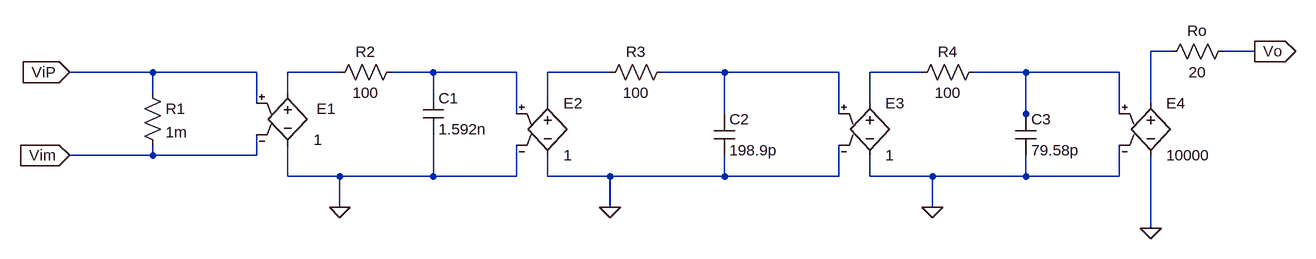
[diagram p0: schematic OpAmp.asc]
OpAmp.asc, the LTspice schematic file:
Version 4
SHEET 1 1708 680
WIRE 1488 -32 1456 -32
WIRE 1616 -32 1568 -32
WIRE -80 0 -208 0
WIRE 80 0 -80 0
WIRE 208 0 128 0
WIRE 352 0 288 0
WIRE 480 0 352 0
WIRE 624 0 528 0
WIRE 800 0 704 0
WIRE 976 0 800 0
WIRE 1104 0 1024 0
WIRE 1264 0 1184 0
WIRE 1408 0 1264 0
WIRE -80 32 -80 0
WIRE 128 32 128 0
WIRE 352 32 352 0
WIRE 80 48 80 0
WIRE 528 48 528 0
WIRE 1024 48 1024 0
WIRE 1456 48 1456 -32
WIRE 480 64 480 0
WIRE 800 64 800 0
WIRE 976 64 976 0
WIRE 1264 64 1264 0
WIRE 1408 64 1408 0
WIRE 1264 80 1264 64
WIRE -80 128 -80 112
WIRE -80 128 -208 128
WIRE 80 128 80 96
WIRE 80 128 -80 128
WIRE 128 160 128 112
WIRE 208 160 128 160
WIRE 352 160 352 96
WIRE 352 160 208 160
WIRE 480 160 480 112
WIRE 480 160 352 160
WIRE 528 160 528 128
WIRE 624 160 528 160
WIRE 800 160 800 128
WIRE 800 160 624 160
WIRE 976 160 976 112
WIRE 976 160 800 160
WIRE 1024 160 1024 128
WIRE 1120 160 1024 160
WIRE 1264 160 1264 128
WIRE 1264 160 1120 160
WIRE 1408 160 1408 112
WIRE 1408 160 1264 160
WIRE 208 208 208 160
WIRE 624 208 624 160
WIRE 1120 208 1120 160
WIRE 1456 240 1456 128
FLAG -208 0 ViP
IOPIN -208 0 In
FLAG -208 128 Vim
IOPIN -208 128 In
FLAG 208 208 0
FLAG 624 208 0
FLAG 1120 208 0
FLAG 1456 240 0
FLAG 1616 -32 Vo
IOPIN 1616 -32 Out
SYMBOL e 128 16 R0
WINDOW 0 44 40 Left 2
WINDOW 3 40 88 Left 2
SYMATTR InstName E1
SYMATTR Value 1
SYMBOL res -96 16 R0
SYMATTR InstName R1
SYMATTR Value 1m
SYMBOL res 304 -16 R90
WINDOW 0 0 56 VBottom 2
WINDOW 3 32 56 VTop 2
SYMATTR InstName R2
SYMATTR Value 100
SYMBOL cap 336 32 R0
SYMATTR InstName C1
SYMATTR Value 1.592n
SYMBOL e 528 32 R0
SYMATTR InstName E2
SYMATTR Value 1
SYMBOL res 720 -16 R90
WINDOW 0 0 56 VBottom 2
WINDOW 3 32 56 VTop 2
SYMATTR InstName R3
SYMATTR Value 100
SYMBOL cap 784 64 R0
SYMATTR InstName C2
SYMATTR Value 198.9p
SYMBOL e 1024 32 R0
SYMATTR InstName E3
SYMATTR Value 1
SYMBOL res 1200 -16 R90
WINDOW 0 0 56 VBottom 2
WINDOW 3 32 56 VTop 2
SYMATTR InstName R4
SYMATTR Value 100
SYMBOL cap 1248 64 R0
SYMATTR InstName C3
SYMATTR Value 79.58p
SYMBOL e 1456 32 R0
SYMATTR InstName E4
SYMATTR Value 10000
SYMBOL res 1584 -48 R90
WINDOW 0 0 56 VBottom 2
WINDOW 3 32 56 VTop 2
SYMATTR InstName Ro
SYMATTR Value 20

The netlist it stands for:
* OpAmp.asc
E1 N002 0 ViP Vim 1
R1 ViP Vim 1m
R2 N003 N002 100
C1 N003 0 1.592n
E2 N004 0 N003 0 1
R3 N005 N004 100
C2 N005 0 198.9p
E3 N006 0 N005 0 1
R4 N007 N006 100
C3 N007 0 79.58p
E4 N001 0 N007 0 10000
Ro Vo N001 20
.backanno
.end